# EAGLE design protogasm (EAGLE 6.6.0)
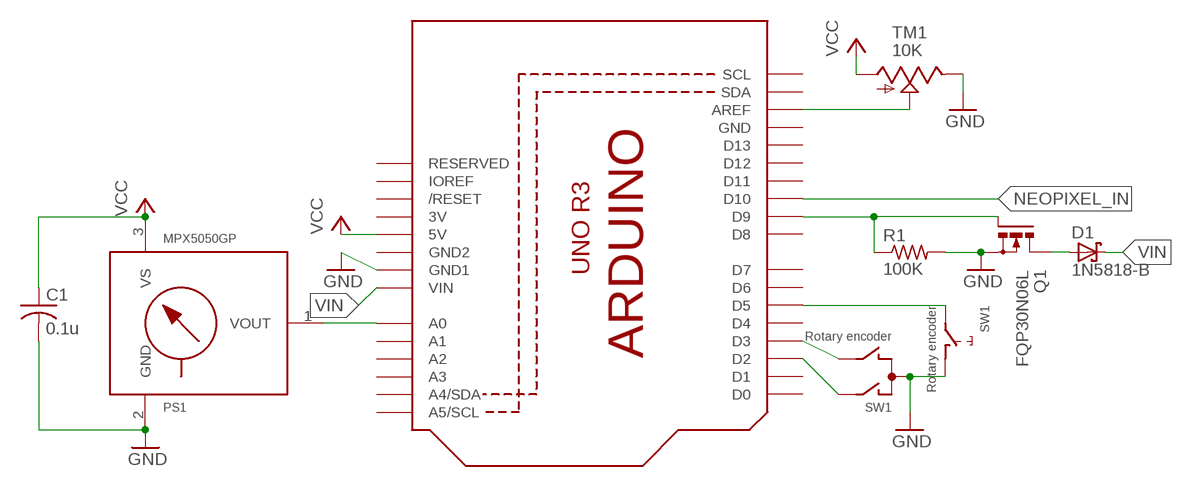
[diagram p0: schematic, sheet 1]

## Parts
C1  0.1u  C-US025-025X050  [C025-025X050]
D1  1N5818-B  [DO41-7.6]
PS1  MPX5050GP  MPX5010GP-H  [867B-H]
Q1  FQP30N06L  PMOSFET_NTO220BH  [TO220BH]
R1  100K  R-US_0207/10  [0207/10]
SW1  Rotary encoder  EC12E_SW  [ALPS_EC12E_SW]
TM1  10K  TRIM  [6MM]
U1  ARDUINOR3PERF  [PERF]

## Nets
GND: C1.2 PS1.2(GND) Q1.S R1.2 SW1.C SW1.D TM1.E U1.GND1 U1.GND1.(GND1)
N$1: SW1.A U1.D2 U1.D2.(D2)
N$2: SW1.B U1.D3 U1.D3.(D3)
N$3: SW1.E U1.D5 U1.D5.(D5)
N$4: TM1.S U1.AREF U1.AREF.(AREF)
N$5: Q1.G R1.1 U1.D9 U1.D9.(D9)
N$6: D1.A Q1.D
N$7: PS1.1(VOUT) U1.A0 U1.A0.(A0)
NEOPIXEL_IN: U1.D10 U1.D10.(D10)
VCC: C1.1 PS1.3(VS) TM1.A U1.5V U1.5V.(5V)
VIN: D1.C U1.VIN U1.VIN.(VIN)
Unconnected: PS1.4(NC) PS1.5(NC) PS1.6(NC) U1.A1 U1.A1.(A1) U1.A2 U1.A2.(A2) U1.A3 U1.A3.(A3) U1.A4(A4/SDA) U1.A4.(A4/SDA) U1.A5(A5/SCL) U1.A5.(A5/SCL) U1.D0 U1.D0.(D0) U1.D1 U1.D1.(D1) U1.D4 U1.D4.(D4) U1.D6 U1.D6.(D6) U1.D7 U1.D7.(D7) U1.D8 U1.D8.(D8) U1.D11 U1.D11.(D11) U1.D12 U1.D12.(D12) U1.D13 U1.D13.(D13) U1.IOREF U1.IOREF.(IOREF) U1.RESERVED U1.RESERVED.(RESERVED) U1.RESET(/RESET) U1.RESET.(/RESET) U1.SCL U1.SCL.(SCL) U1.SDA U1.SDA.(SDA)

## Power pins joined to a net without a drawn wire
3V: U1.3V U1.3V.(3V)
GND: U1.GND U1.GND.(GND)
GND2: U1.GND2 U1.GND2.(GND2)

## Library data of the parts
C1 = rcl:C-US: CAPACITOR, American symbol
D1 = diode:1N581*: 1.0A SCHOTTKY BARRIER RECTIFIER Source: http://www.diodes.com/datasheets/ds23001.pdf
PS1 = mpx-freescale-hax:MPX5010: Integrated Silicon Pressure Sensor On-Chip Signal Conditioned, Temperature Compensated and Calibrated
Q1 = transistor-power:PMOSFET_N: Power MOSFET N-Channel
R1 = rcl:R-US_: RESISTOR, American symbol
SW1 = switch-alps-hax:EC12E_SW: ALPS rotary Encoder EC12E series with switch; MPN: EC12E2424407; OC_FARNELL: 1520813; OC_NEWARK: 74M1068
TM1 = adafruit:TRIM
U1 = adafruit-hax-2:ARDUINOR3: Electronics Salon Arduino Uno R3 Perfboard

## Board
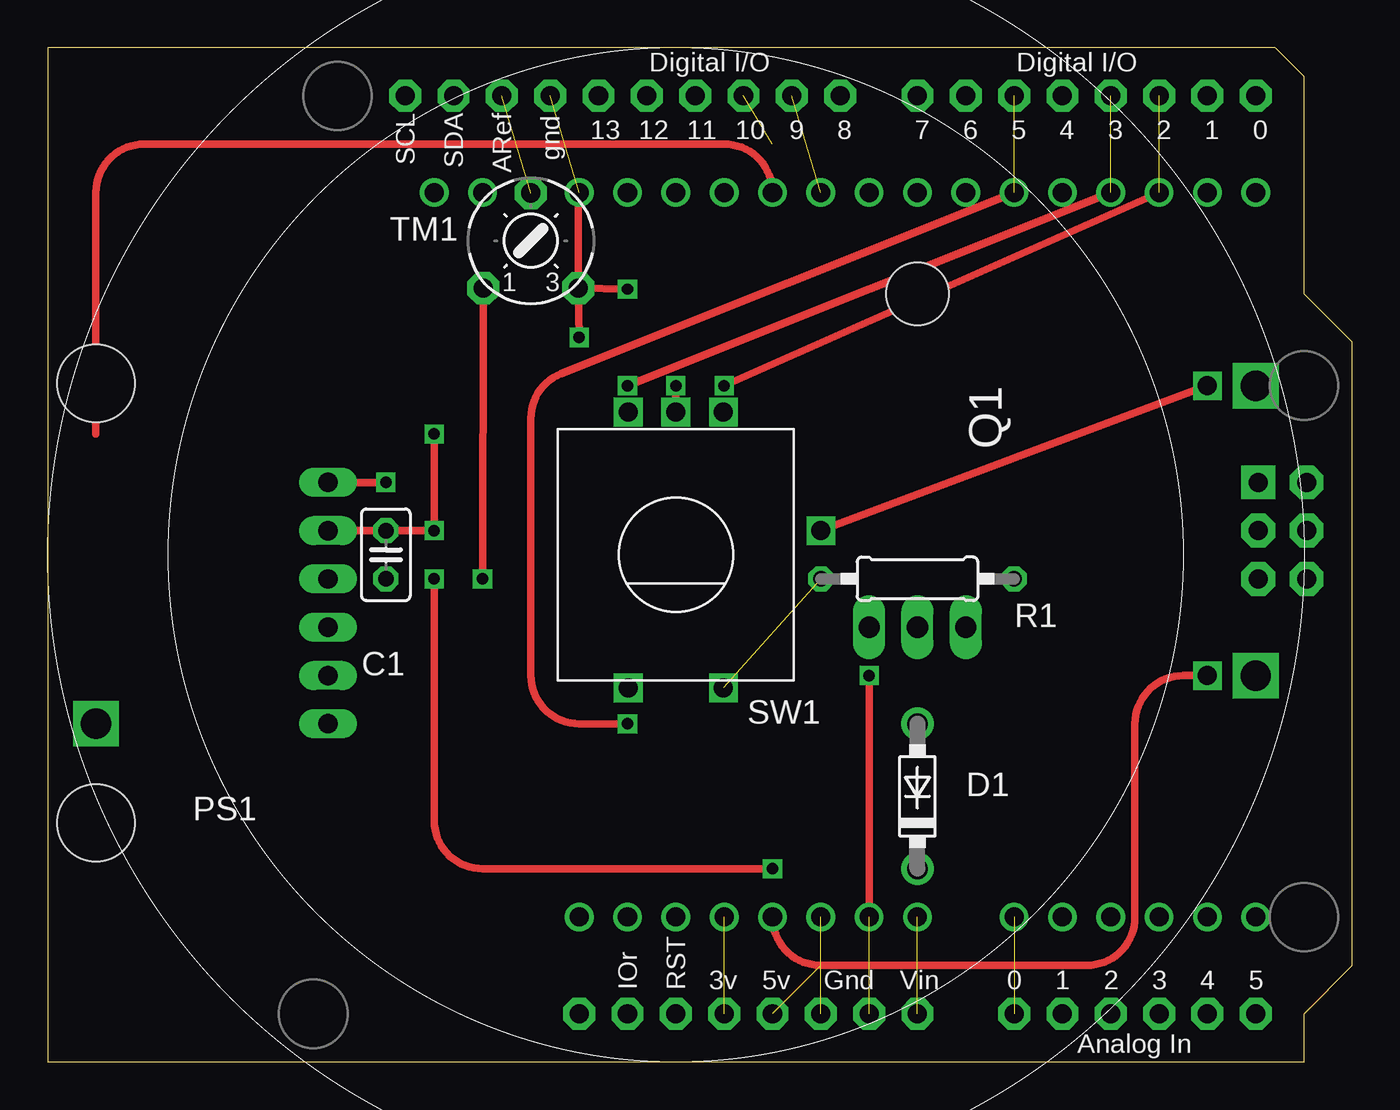
[diagram p1: board, top side]
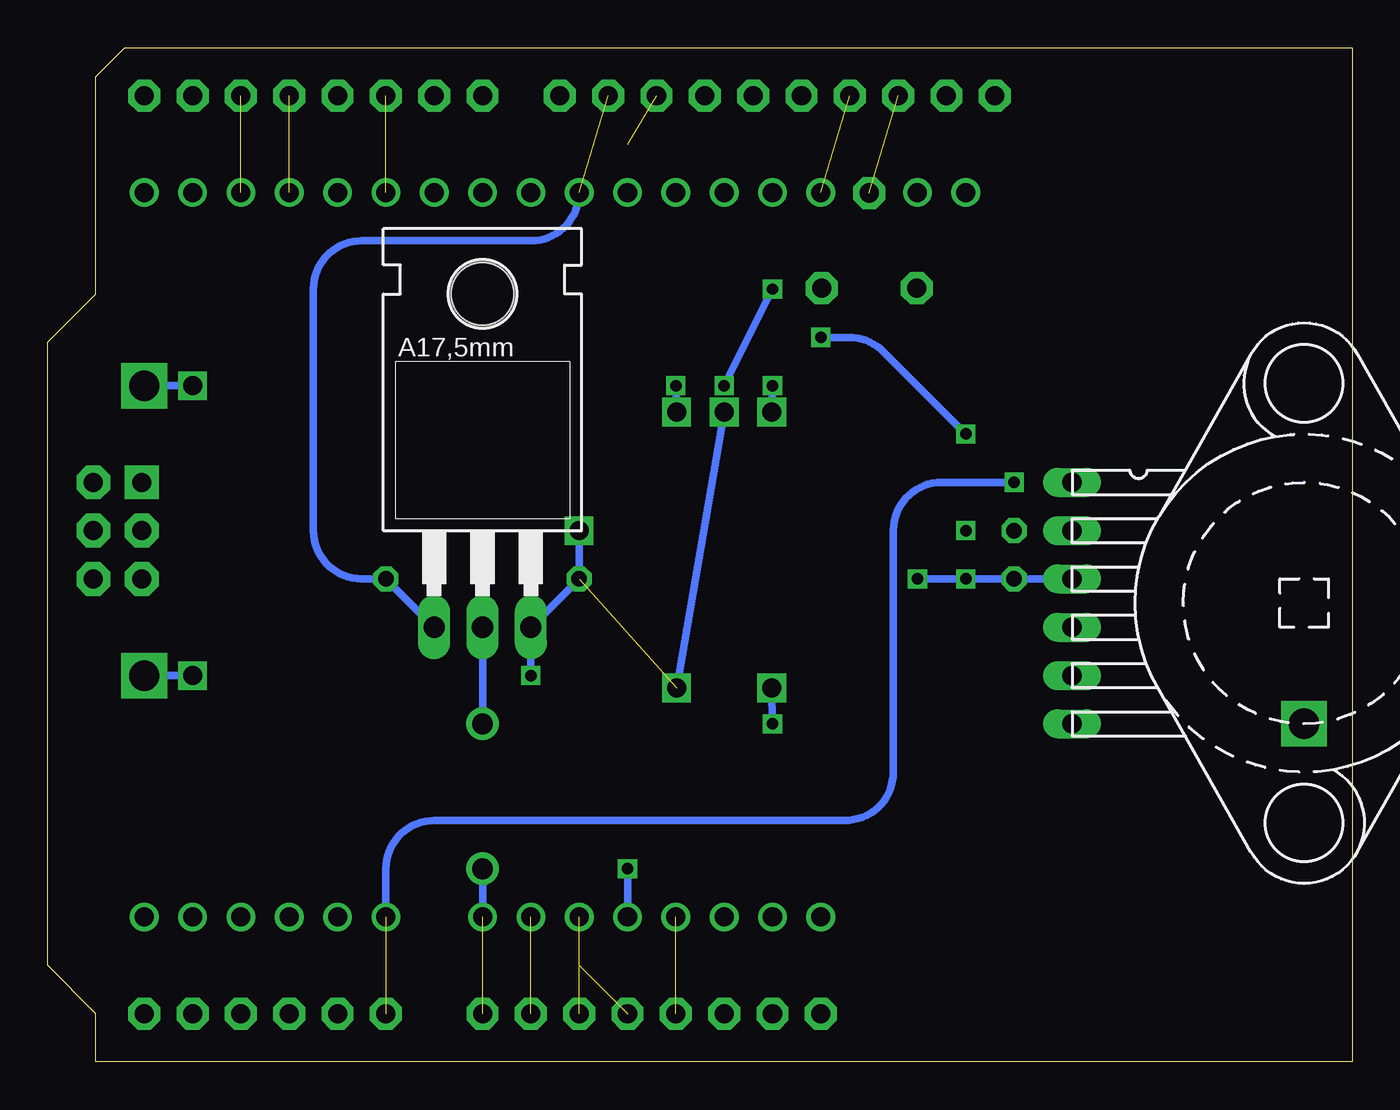
[diagram p2: board, bottom side, seen from below]

Size 68.58 x 53.34 mm. Coordinates in mm from the lower left corner, seen from the top.
Copper layers (1*16): Top 0.035mm / dielectric 1.5mm / Bottom 0.035mm
Design rules "default": minimum track width 10mil, minimum drill 24mil, track to track 8mil, track to pad 8mil, pad to pad 8mil, via to via 8mil, smd to smd 8mil, copper to edge 40mil, drill to drill 8mil, minimum pad ring 10mil, minimum via ring 8mil, stop-mask expansion 4mil, vias tented up to drill 0mil, thermal gap 10mil

### Footprints (pad centres in the part's own frame; a part is rotated, then mirrored left to right if it is on the bottom)
C025-025X050 = drill 0.813 octagon: 1 -1.27,0; 2 1.27,0
DO41-7.6 = drill 1.1 pad 1.7: A 3.81,0; C -3.81,0
867B-H = drill 1.016 long: 1 -6.35,-12.192; 2 -3.81,-12.192; 3 -1.27,-12.192; 4 1.27,-12.192; 5 3.81,-12.192; 6 6.35,-12.192 | hole 4.064: -11.557,0; 11.557,0
TO220BH = drill 1.118 long: D 0,-6.35; G -2.54,-6.35; S 2.54,-6.35 | hole 3.302: 0,11.176
0207/10 = drill 0.813 octagon: 1 -5.08,0; 2 5.08,0
ALPS_EC12E_SW = drill 1 square: A -2.5,-7.5; B 2.5,-7.5; C 0,-7.5; D -2.5,7; E 2.5,7
6MM = drill 1 pad 1.676 octagon: A -2.5,-2.5; E 2.5,-2.5; S 0,2.5
PERF = drill 1 pad 1.676 octagon: 3V 35.56,2.54; 5V 38.1,2.54; A0 50.8,2.54; A1 53.34,2.54; A2 55.88,2.54; A3 58.42,2.54; A4 60.96,2.54; A5 63.5,2.54; AREF 23.876,50.8; D0 63.5,50.8; D1 60.96,50.8; D2 58.42,50.8; D3 55.88,50.8; D4 53.34,50.8; D5 50.8,50.8; D6 48.26,50.8; D7 45.72,50.8; D8 41.656,50.8; D9 39.116,50.8; D10 36.576,50.8; D11 34.036,50.8; D12 31.496,50.8; D13 28.956,50.8; GND 26.416,50.8; GND1 43.18,2.54; GND2 40.64,2.54; IOREF 30.48,2.54; RESERVED 27.94,2.54; RESET 33.02,2.54; SCL 18.796,50.8; SDA 21.336,50.8; VIN 45.72,2.54 | drill 1: 3V. 35.56,7.62; 5V. 38.1,7.62; A0. 50.8,7.62; A1. 53.34,7.62; A2. 55.88,7.62; A3. 58.42,7.62; A4. 60.96,7.62; A5. 63.5,7.62; AREF. 25.4,45.72; D0. 63.5,45.72; D1. 60.96,45.72; D2. 58.42,45.72; D3. 55.88,45.72; D4. 53.34,45.72; D5. 50.8,45.72; D6. 48.26,45.72; D7. 45.72,45.72; D8. 43.18,45.72; D9. 40.64,45.72; D10. 38.1,45.72; D11. 35.56,45.72; D12. 33.02,45.72; D13. 30.48,45.72; GND1. 43.18,7.62; GND2. 40.64,7.62; GND. 27.94,45.72; IOREF. 30.48,7.62; RESERVED. 27.94,7.62; RESET. 33.02,7.62; SCL. 20.32,45.72; SDA. 22.86,45.72; VIN. 45.72,7.62 | drill 1 pad 1.778 octagon: 5V_ICSP 66.167,30.48; GND@3 66.167,25.4; MOSI 66.167,27.94; RESET_ICSP 63.627,25.4; SCK 63.627,27.94 | drill 1 pad 1.778 square: MISO 63.627,30.48

### Placement (x,y rotation side)
C1  17.78,26.67 90 top
D1  45.72,13.97 90 top
PS1  2.54,24.13 270 bottom
Q1  45.72,29.21 0 bottom
R1  45.72,25.4 180 top
SW1  33.02,26.67 180 top
TM1  25.4,43.18 0 top
U1  0,0 0 top

### Tracks (layer width: path | path; a pad name or v marks a point on that pad's centre or on a via)
3V  (1 unrouted)
GND  (via drill 0.6, 1, 1.6)  (3 unrouted)
  Top 0.406: U1.GND1. v43.18,20.32 | SW1.C v33.02,35.56 | v30.48,40.64 TM1.E | PS1.2 C1.2 v20.32,27.94 v20.32,33.02 | v27.94,38.1 TM1.E | v40.64,27.94 v60.96,35.56 | TM1.E 27.9,45.68 arc-90 U1.GND.
  Bottom 0.406: SW1.D SW1.C | v43.18,20.32 Q1.S R1.2 v40.64,27.94 | v33.02,35.56 v30.48,40.64 | v27.94,38.1 26.45,38.1 arc45 24.66,37.36 v20.32,33.02 | v60.96,35.56 v63.5,35.56
GND2  (1 unrouted)
N$1  (via drill 0.6)  (1 unrouted)
  Top 0.406: U1.D2. v35.56,35.56
  Bottom 0.406: v35.56,35.56 SW1.A
N$2  (via drill 0.6)  (1 unrouted)
  Top 0.406: U1.D3. v30.48,35.56
  Bottom 0.406: v30.48,35.56 SW1.B
N$3  (via drill 0.6)  (1 unrouted)
  Top 0.406: U1.D5. 27,36.2 arc68 25.4,33.84 25.4,20.32 arc90 27.94,17.78 v30.48,17.78
  Bottom 0.406: v30.48,17.78 SW1.E
N$4  (2 unrouted)
N$5  (1 unrouted)
  Bottom 0.406: Q1.G R1.1 52.07,25.4 arc90 54.61,27.94 54.61,40.64 arc90 52.07,43.18 43.18,43.18 arc-90 U1.D9.
N$6
  Bottom 0.406: D1.A Q1.D
N$7  (via drill 0.6)  (1 unrouted)
  Top 0.406: PS1.1 v17.78,30.48
  Bottom 0.406: v17.78,30.48 21.59,30.48 arc-90 24.13,27.94 24.13,15.24 arc90 26.67,12.7 48.26,12.7 arc-90 50.8,10.16 U1.A0.
N$10  (via drill 1.6)
  other vias: 2.54,17.78
NEOPIXEL_IN  (1 unrouted)
  Top 0.406: U1.D10. arc90 35.56,48.26 5.08,48.26 arc90 2.54,45.72 2.54,33.02
VCC  (via drill 0.6, 1, 1.6)  (1 unrouted)
  Top 0.406: TM1.A v22.86,25.4 | v20.32,25.4 20.32,12.7 arc90 22.86,10.16 v38.1,10.16 | U1.5V. arc90 40.64,5.08 54.61,5.08 arc90 57.15,7.62 57.15,17.78 arc-90 59.69,20.32 v60.96,20.32
  Bottom 0.406: PS1.3 C1.1 v20.32,25.4 v22.86,25.4 | v38.1,10.16 U1.5V. | v63.5,20.32 v60.96,20.32
VIN  (1 unrouted)
  Bottom 0.406: U1.VIN. D1.C

### Text on the board
Document: NeoPixel Ring DATA IN is here / but DO NOT use a pin header in / this location. It will short against / the USB port. Solder the wire to / the ring. | Ring GND | Ring OUT | Ring PWR | Motor connection | White: Top components / Yellow: Bottom components / Red: Top wiring / Cyan: Bottom wiring / / Vias indicate where wires are / soldered to perfboardand and / are folded on the opposite side.